# Altium schematic sheet Top.SchDoc
size A; SheetNumber: 1; SheetTotal: 3
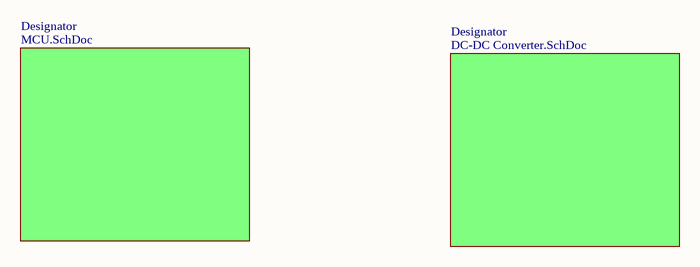
[diagram p0: Top.SchDoc]

## Sub-sheets
Designator = DC-DC Converter.SchDoc: no entries
Designator = MCU.SchDoc: no entries